# Altium project Motee_v2.PrjPcb
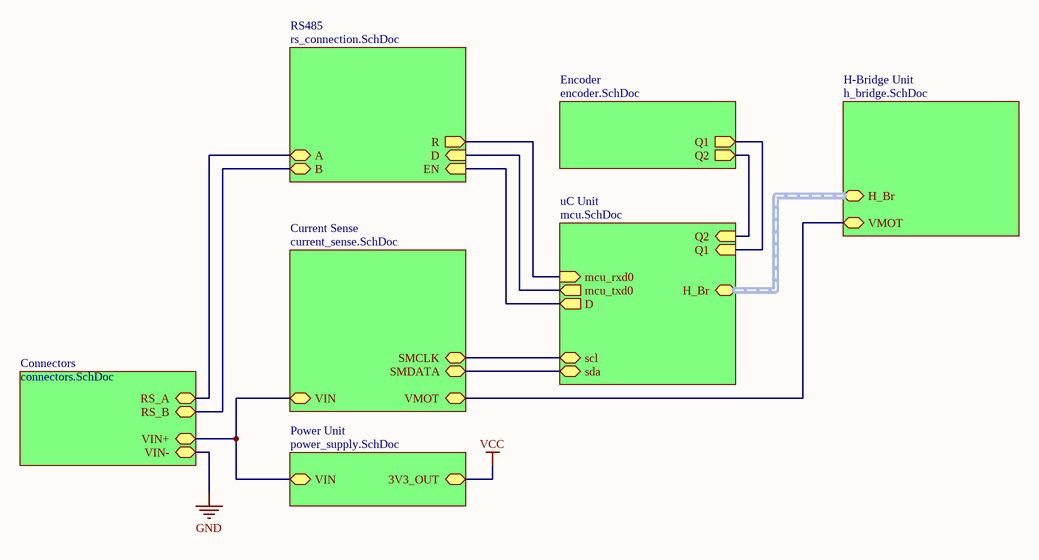
[diagram p0: main.SchDoc]
7 sheets, 16 parts. Net scope: hierarchical (ports join the sheet entries above them; power ports are global).
Sheets:
  main.SchDoc
    Power Unit = power_supply.SchDoc
    uC Unit = mcu.SchDoc
    H-Bridge Unit = h_bridge.SchDoc
    RS485 = rs_connection.SchDoc
    Current Sense = current_sense.SchDoc
    Connectors = connectors.SchDoc

## Sheet main.SchDoc
size A4

### Sub-sheets
Connectors = connectors.SchDoc: VIN+, RS_B, RS_A, VIN-
Current Sense = current_sense.SchDoc: SMCLK, SMDATA, VIN, VMOT
Encoder = encoder.SchDoc (file not in this document): Q2 (out), Q1 (out)
H-Bridge Unit = h_bridge.SchDoc: H_Br (harness H_Bridge_Harness), VMOT
Power Unit = power_supply.SchDoc: VIN, 3V3_OUT
RS485 = rs_connection.SchDoc: A, B, EN (in), D (in), R (out)
uC Unit = mcu.SchDoc: H_Br (harness H_Bridge_Harness), mcu_rxd0 (in), mcu_txd0 (out), scl (bidir), sda (bidir), D (out), Q1 (in), Q2 (in)

### Nets
A: sheet RS485/A, sheet Connectors/RS_A
B: sheet RS485/B, sheet Connectors/RS_B
NetC18_1: sheet Power Unit/VIN, sheet Current Sense/VIN, sheet Connectors/VIN+
NetR1_1: sheet H-Bridge Unit/VMOT, sheet Current Sense/VMOT
NetR2_1: sheet uC Unit/scl, sheet Current Sense/SMCLK
NetR3_1: sheet uC Unit/sda, sheet Current Sense/SMDATA
NetU2_2: sheet uC Unit/D, sheet RS485/EN
NetU2_3: sheet uC Unit/mcu_rxd0, sheet RS485/R
NetU2_4: sheet uC Unit/mcu_txd0, sheet RS485/D
(unnamed): sheet uC Unit/Q1, sheet Encoder/Q1
(unnamed): sheet uC Unit/Q2, sheet Encoder/Q2

### Buses and harness runs
harness sheet H-Bridge Unit/H_Br = sheet uC Unit/H_Br

## Sheet power_supply.SchDoc
size A4
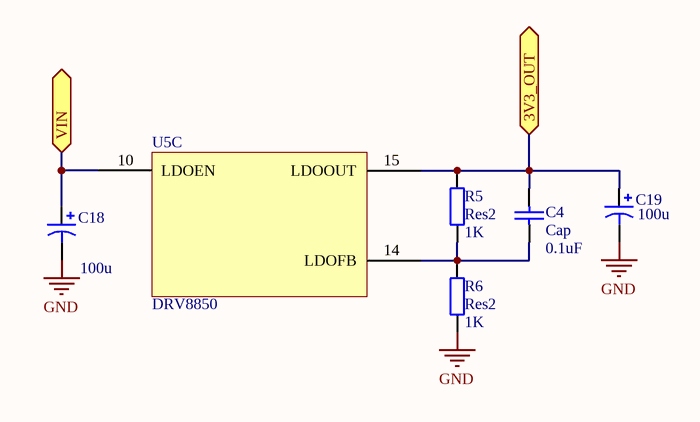
[diagram p1: power_supply.SchDoc]

### Parts
C4  Cap  value 0.1uF  [RAD-0.3]
C18  value 100u  [Tantalum_cap_D]
C19  value 100u  [Tantalum_cap_D]
R5  Res2  value 1K  [AXIAL-0.4]
R6  Res2  value 1K  [AXIAL-0.4]
U5  DRV8850  (part C of 3)

### Ports
3V3_OUT, VIN

### Nets
GND: C18.2 C19.2 R6.1
VCC: C4.2 C19.1 R5.2 U5.15(LDOOUT) ; port 3V3_OUT
NetC4_1: C4.1 R5.1 R6.2 U5.14(LDOFB)
NetC18_1: C18.1 U5.10(LDOEN) ; port VIN

### Library data of the parts
C4 = Cap: Capacitor; Published: 8-Jun-2000; LatestRevisionDate: 17-Jul-2002; LatestRevisionNote: Re-released for DXP Platform.; PackageReference: RAD-0.3; Publisher: Altium Limited; PackageDescription: Radial Cap, Thru-Hole; 2 Leads; 0.3 in Pin Spacing
C18 C19 = Cap Pol1: Polarized Capacitor (Radial); Published: 8-Jun-2000; LatestRevisionDate: 17-Jul-2002; LatestRevisionNote: Re-released for DXP Platform.; PackageReference: RB7.6-15; Publisher: Altium Limited; PackageDescription: Polarized Capacitor (Radial); 2 Leads
R5 R6 = Res2: Resistor; Published: 8-Jun-2000; LatestRevisionDate: 17-Jul-2002; LatestRevisionNote: Re-released for DXP Platform.; PackageReference: AXIAL-0.4; Publisher: Altium Limited; PackageDescription: Axial Device, Thru-Hole; 2 Leads; 0.4 in Pin Spacing

## Sheet mcu.SchDoc
size A4
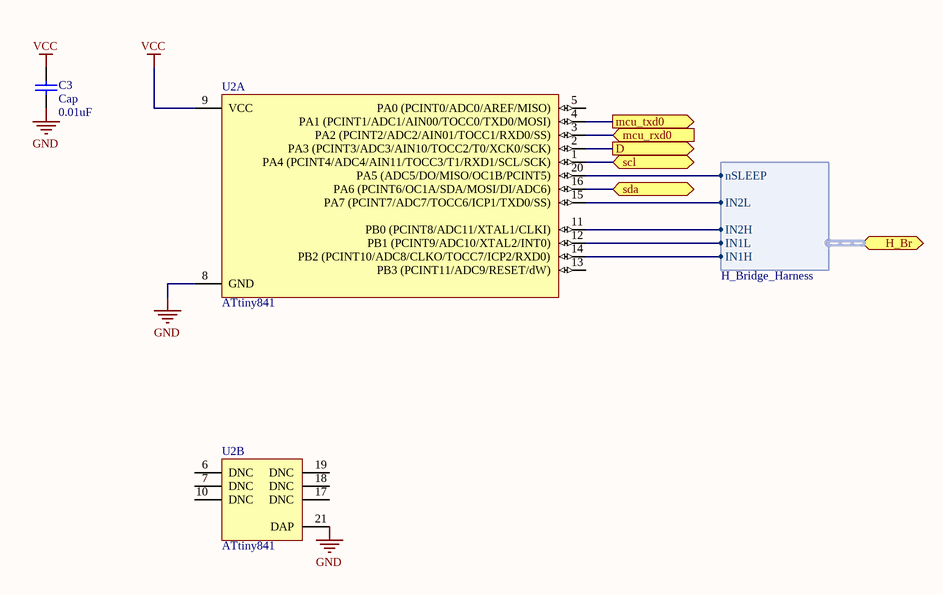
[diagram p2: mcu.SchDoc]

### Parts
C3  Cap  value 0.01uF  [RAD-0.3]
U2  ATtiny841  [20M1_L]  (parts A,B of 2)

### Ports
D (out), H_Br (harness H_Bridge_Harness), mcu_rxd0 (in), mcu_txd0 (out), scl (bidir), sda (bidir)

### Harnesses
H_Bridge_Harness: IN1H, IN1L, IN2H, IN2L, nSLEEP

### Nets
GND: C3.1 U2.8(GND) U2.21(DAP)
VCC: C3.2 U2.9(VCC)
NetR2_1: U2.1(PA4_(PCINT4/ADC4/AIN11/TOCC3/T1/RXD1/SCL/SCK)) ; port scl
NetR3_1: U2.16(PA6_(PCINT6/OC1A/SDA/MOSI/DI/ADC6)) ; port sda
NetU2_2: U2.2(PA3_(PCINT3/ADC3/AIN10/TOCC2/T0/XCK0/SCK)) ; port D
NetU2_3: U2.3(PA2_(PCINT2/ADC2/AIN01/TOCC1/RXD0/SS)) ; port mcu_rxd0
NetU2_4: U2.4(PA1_(PCINT1/ADC1/AIN00/TOCC0/TXD0/MOSI)) ; port mcu_txd0
NetU2_11: U2.11(PB0_(PCINT8/ADC11/XTAL1/CLKI)) ; port H_Br.IN2H
NetU2_12: U2.12(PB1_(PCINT9/ADC10/XTAL2/INT0)) ; port H_Br.IN1L
NetU2_14: U2.14(PB2_(PCINT10/ADC8/CLKO/TOCC7/ICP2/RXD0)) ; port H_Br.IN1H
NetU2_15: U2.15(PA7_(PCINT7/ADC7/TOCC6/ICP1/TXD0/SS)) ; port H_Br.IN2L
NetU2_20: U2.20(PA5_(ADC5/DO/MISO/OC1B/PCINT5)) ; port H_Br.nSLEEP

Not connected (* = marked no-connect by the designer): U2 5(PA0_(PCINT0/ADC0/AREF/MISO)) 6(DNC) 7(DNC) 10(DNC) 13(PB3_(PCINT11/ADC9/RESET/dW)) 17(DNC) 18(DNC) 19(DNC)

### Library data of the parts
C3 = Cap: Capacitor; Published: 8-Jun-2000; LatestRevisionDate: 17-Jul-2002; LatestRevisionNote: Re-released for DXP Platform.; PackageReference: RAD-0.3; Publisher: Altium Limited; PackageDescription: Radial Cap, Thru-Hole; 2 Leads; 0.3 in Pin Spacing
U2 = ATtiny841: 8-bit AVR Microcontroller with 4/8K Bytes In-System  Programmable Flash; DatasheetVersion: revK, Oct-2010; PackageVersion: revA, Oct-2004; PackageReference: 20M1; PackageDescription: 20-pad, 4 x 4 x 0.8 mm Body, Lead Pitch 0.50 mm, 2.6 mm Exposed Pad, Micro Lead Frame Package (MLF); Code_JEDEC: MO-220WGGD-5; ComponentLink1Description: Manufacturer URL; ComponentLink1URL: http://www.atmel.com/; ComponentLink2Description: ATtiny24/44/84 Datasheet; ComponentLink2URL: http://www.atmel.com/Images/Atmel-8495-8-bit-AVR-Microcontrollers-ATtiny441-ATtiny841_Datasheet.pdf; ComponentLink3Description: ATtiny24/44/84 Summary; ComponentLink3URL: http://www.atmel.com/dyn/resources/prod_documents/8006S.pdf

## Sheet h_bridge.SchDoc
size A4
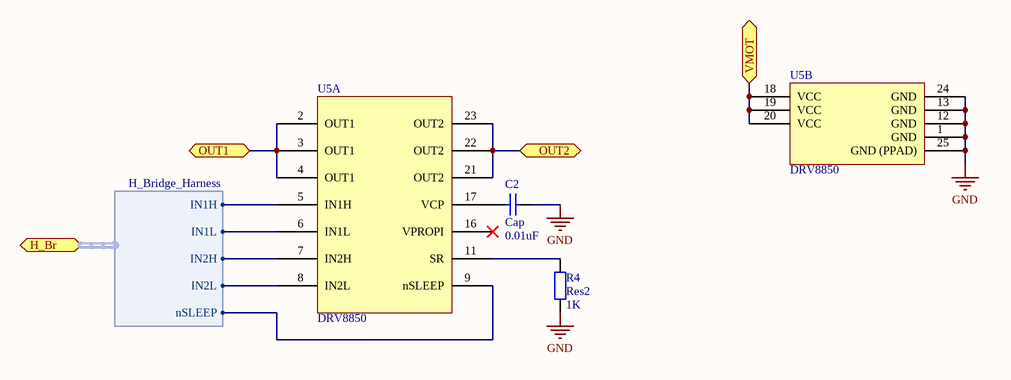
[diagram p3: h_bridge.SchDoc]

### Parts
C2  Cap  value 0.01uF  [RAD-0.3]
R4  Res2  value 1K  [AXIAL-0.4]
U5  DRV8850  (parts A,B of 3)

### Ports
H_Br (harness H_Bridge_Harness), OUT1, OUT2, VMOT

### Harnesses
H_Bridge_Harness: IN1H, IN1L, IN2H, IN2L, nSLEEP

### Nets
GND: C2.2 R4.1 U5.1(GND) U5.12(GND) U5.13(GND) U5.24(GND) U5.25(GND_(PPAD))
NetC2_1: C2.1 U5.17(VCP)
NetR1_1: U5.18(VCC) U5.19(VCC) U5.20(VCC) ; port VMOT
NetR4_2: R4.2 U5.11(SR)
NetU2_11: U5.7(IN2H) ; port H_Br.IN2H
NetU2_12: U5.6(IN1L) ; port H_Br.IN1L
NetU2_14: U5.5(IN1H) ; port H_Br.IN1H
NetU2_15: U5.8(IN2L) ; port H_Br.IN2L
NetU2_20: U5.9(nSLEEP) ; port H_Br.nSLEEP
NetU5_2: U5.2(OUT1) U5.3(OUT1) U5.4(OUT1) ; port OUT1
NetU5_21: U5.21(OUT2) U5.22(OUT2) U5.23(OUT2) ; port OUT2

Not connected (* = marked no-connect by the designer): U5 16(VPROPI)*

### Library data of the parts
C2 = Cap: Capacitor; Published: 8-Jun-2000; LatestRevisionDate: 17-Jul-2002; LatestRevisionNote: Re-released for DXP Platform.; PackageReference: RAD-0.3; Publisher: Altium Limited; PackageDescription: Radial Cap, Thru-Hole; 2 Leads; 0.3 in Pin Spacing
R4 = Res2: Resistor; Published: 8-Jun-2000; LatestRevisionDate: 17-Jul-2002; LatestRevisionNote: Re-released for DXP Platform.; PackageReference: AXIAL-0.4; Publisher: Altium Limited; PackageDescription: Axial Device, Thru-Hole; 2 Leads; 0.4 in Pin Spacing

## Sheet rs_connection.SchDoc
size A4
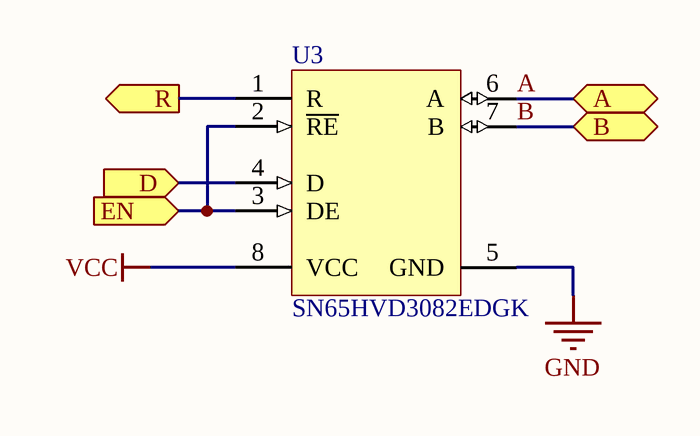
[diagram p4: rs_connection.SchDoc]

### Parts
U3  SN65HVD3082EDGK  [DGK8_L]

### Ports
A (bidir), B (bidir), D (in), EN (in), R (out)

### Nets
GND: U3.5(GND)
VCC: U3.8(VCC)
A: U3.6(A) ; port A
B: U3.7(B) ; port B
NetU2_2: U3.2(~{RE}) U3.3(DE) ; port EN
NetU2_3: U3.1(R) ; port R
NetU2_4: U3.4(D) ; port D

### Library data of the parts
U3 = SN65HVD3082EDGK: Low-Power RS-485 Transceiver, 0.2 Mbps, 5 V, Half Duplex, -40 to 85 degC, 8-pin MSOP (DGK), Green (RoHS & no Sb/Br); Manufacturer: Texas Instruments; # of TX/RX: 1 TX / 1 RX; Drivers Per Package: 1; Number of Nodes: 256; Signaling Rate(Mbps): 0.2; Common Mode Range: -7 to 12; ESD(kV): 15; Fault Protection(V): -9 to 14; Fail Safe: Idle, Open, Short; ICC(Max)(mA): 0.9; Supply Voltage(s)(V): 5; Rating: Catalog; DatasheetVersion: SLLS562G; PackageVersion: revE, May-2006; PackageReference: DGK8; PackageDescription: 8-Pin Thin Small Outline Package 3 x 3 mm Body ,0.65 mm Pitch; Supplier 1: Digi-Key; Supplier Part Number 1: 296-17929-ND; Supplier 2: Newark; Supplier Part Number 2: 01J0699; Supplier 3: Mouser; Supplier Part Number 3: 595-SN65HVD3082EDGK; Eco-Plan: Green (RoHS & no Sb/Br); SubFamily: RS-485; Receivers Per Package: 1; Isolated: No; Duplex: Half; Footprint: SN75176; Mounting Technology: Surface Mount; PartNumber: SN65HVD3082EDGK; Code_JEDEC: MO-187-AA; ComponentLink1Description: Datasheet; ComponentLink1URL: http://www.ti.com/general/docs/lit/getliterature.tsp?genericPartNumber=SN65HVD3082E&fileType=pdf; ComponentLink2Description: Package Specification; ComponentLink2URL: http://www.ti.com/litv/pdf/msoi002j

## Sheet current_sense.SchDoc
size A4
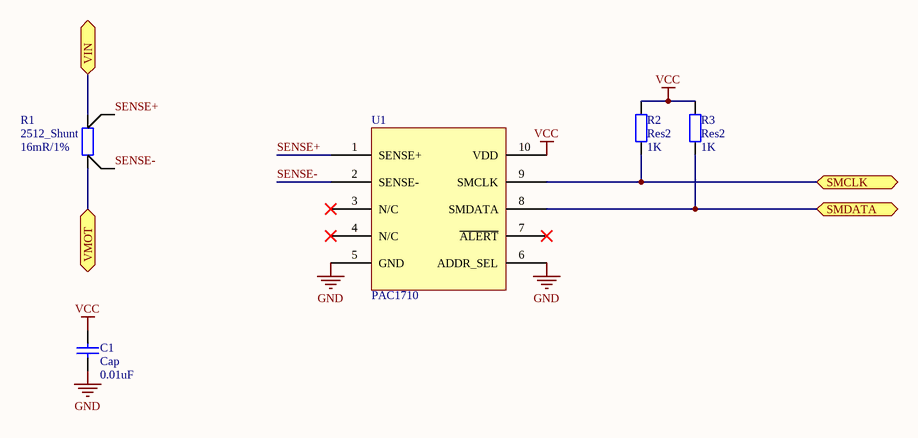
[diagram p5: current_sense.SchDoc]

### Parts
C1  Cap  value 0.01uF  [RAD-0.3]
R1  Package: 2512_Shunt  [SMD_Resistor-shunt_2512]  (hidden comment: 16mR/1%)
R2  Res2  value 1K  [AXIAL-0.4]
R3  Res2  value 1K  [AXIAL-0.4]
U1  PAC1710

### Ports
SMCLK (bidir), SMDATA (bidir), VIN, VMOT

### Nets
GND: C1.1 U1.5(GND) U1.6(ADDR_SEL)
VCC: C1.2 R2.2 R3.2 U1.10(VDD)
SENSE+: R1.3 U1.1(SENSE+)
SENSE-: R1.2 U1.2(SENSE-)
NetC18_1: R1.4 ; port VIN
NetR1_1: R1.1 ; port VMOT
NetR2_1: R2.1 U1.9(SMCLK) ; port SMCLK
NetR3_1: R3.1 U1.8(SMDATA) ; port SMDATA

Not connected (* = marked no-connect by the designer): U1 3(N/C)* 4(N/C)* 7(~{ALERT})*

### Library data of the parts
C1 = Cap: Capacitor; Published: 8-Jun-2000; LatestRevisionDate: 17-Jul-2002; LatestRevisionNote: Re-released for DXP Platform.; PackageReference: RAD-0.3; Publisher: Altium Limited; PackageDescription: Radial Cap, Thru-Hole; 2 Leads; 0.3 in Pin Spacing
R1 = 352115RFT: TE CONNECTIVITY  352115RFT  RESISTOR, 2512, 2W, 15R, 1%; Temperature Coefficient: ± 100ppm/°C; Manufacturer: TE CONNECTIVITY; ManufacturerPartNumber: 352115RFT; Power Rating: 2 W; Farnell: http://pl.farnell.com/te-connectivity/352115rft/resistor-2512-2w-15r-1/dp/2117454; Manufacturer's Datasheet: http://www.farnell.com/datasheets/1610601.pdf; Value: 16mR/1%
R2 R3 = Res2: Resistor; Published: 8-Jun-2000; LatestRevisionDate: 17-Jul-2002; LatestRevisionNote: Re-released for DXP Platform.; PackageReference: AXIAL-0.4; Publisher: Altium Limited; PackageDescription: Axial Device, Thru-Hole; 2 Leads; 0.4 in Pin Spacing

## Sheet connectors.SchDoc
size A4
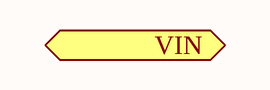
[diagram p6: connectors.SchDoc]

### Ports
VIN

## Nets that join several sheets
GND: power_supply (C18.2 C19.2 R6.1), mcu (C3.1 U2.8 U2.21), h_bridge (7 pins), rs_connection (U3.5), current_sense (C1.1 U1.5 U1.6)
VCC: power_supply (C4.2 C19.1 R5.2 U5.15), mcu (C3.2 U2.9), rs_connection (U3.8), current_sense (C1.2 R2.2 R3.2 U1.10)
NetC18_1: power_supply (C18.1 U5.10), current_sense (R1.4)
NetR1_1: h_bridge (U5.18 U5.19 U5.20), current_sense (R1.1)
NetR2_1: mcu (U2.1), current_sense (R2.1 U1.9)
NetR3_1: mcu (U2.16), current_sense (R3.1 U1.8)
NetU2_2: mcu (U2.2), rs_connection (U3.2 U3.3)
NetU2_3: mcu (U2.3), rs_connection (U3.1)
NetU2_4: mcu (U2.4), rs_connection (U3.4)
NetU2_11: mcu (U2.11), h_bridge (U5.7)
NetU2_12: mcu (U2.12), h_bridge (U5.6)
NetU2_14: mcu (U2.14), h_bridge (U5.5)
NetU2_15: mcu (U2.15), h_bridge (U5.8)
NetU2_20: mcu (U2.20), h_bridge (U5.9)